# EAGLE design controller (EAGLE 6.6.0)
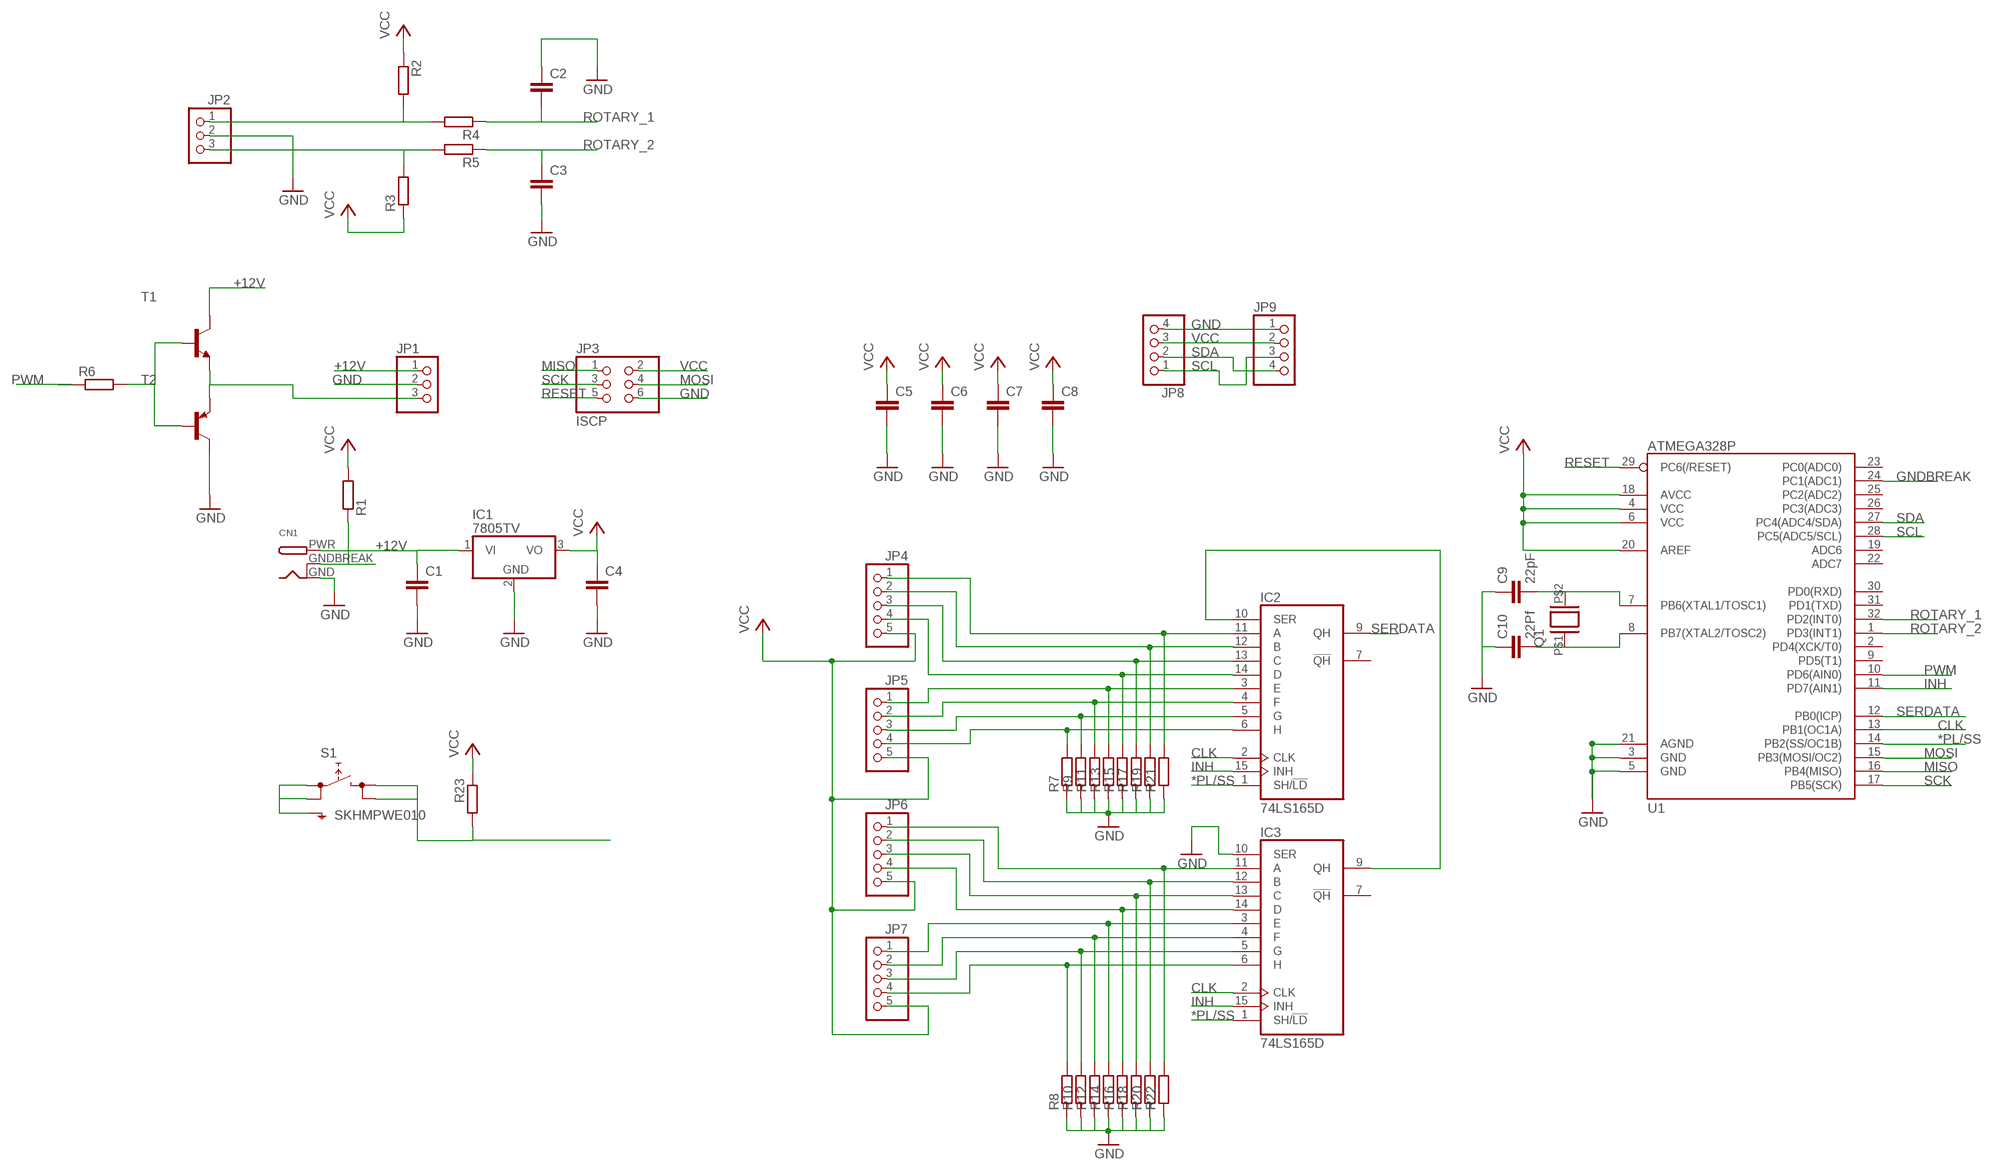
[diagram p0: schematic, sheet 1]

## Parts
C1  C-EUC0805  [C0805]
C2  C-EUC0805  [C0805]
C3  C-EUC0805  [C0805]
C4  C-EUC0805  [C0805]
C5  C-EUC0805  [C0805]
C6  C-EUC0805  [C0805]
C7  C-EUC0805  [C0805]
C8  C-EUC0805  [C0805]
C9  22pF  C-EUC0805  [C0805]
C10  22Pf  C-EUC0805  [C0805]
CN1  DCBARRELPTH  [DCJACK_2MM_PTH]
IC1  7805TV  [TO220V]
IC2  74LS165D  [SO16]
IC3  74LS165D  [SO16]
JP1  PINHD-1X3  [1X03]
JP2  PINHD-1X3  [1X03]
JP3  ISCP  PINHD-2X3  [2X03]
JP4  PINHD-1X5  [1X05]
JP5  PINHD-1X5  [1X05]
JP6  PINHD-1X5  [1X05]
JP7  PINHD-1X5  [1X05]
JP8  PINHD-1X4  [1X04]
JP9  PINHD-1X4  [1X04]
Q1  XTAL  [CSM-3X]
R1  R-EU_R0805  [R0805]
R2  R-EU_R0805  [R0805]
R3  R-EU_R0805  [R0805]
R4  R-EU_R0805  [R0805]
R5  R-EU_R0805  [R0805]
R6  R-EU_R0805  [R0805]
R7  R-EU_R0805  [R0805]
R8  R-EU_R0805  [R0805]
R9  R-EU_R0805  [R0805]
R10  R-EU_R0805  [R0805]
R11  R-EU_R0805  [R0805]
R12  R-EU_R0805  [R0805]
R13  R-EU_R0805  [R0805]
R14  R-EU_R0805  [R0805]
R15  R-EU_R0805  [R0805]
R16  R-EU_R0805  [R0805]
R17  R-EU_R0805  [R0805]
R18  R-EU_R0805  [R0805]
R19  R-EU_R0805  [R0805]
R20  R-EU_R0805  [R0805]
R21  R-EU_R0805  [R0805]
R22  R-EU_R0805  [R0805]
R23  R-EU_R0805  [R0805]
S1  SKHMPWE010  [SKHMPXE010]
T1  BC847-NPN-SOT23-BEC  [SOT23-BEC]
T2  BC807-16-PNP-SOT23-BEC  [SOT23-BEC]
U1  ATMEGA328P  ATMEGA328_SMT  [TQFP32-08]

## Nets
*PL/SS: IC2.1(SH/!LD) IC3.1(SH/!LD) U1.14(PB2(SS/OC1B))
+12V [high power]: C1.1 CN1.PWR IC1.1(VI) JP1.1 T1.C
CLK: IC2.2(CLK) IC3.2(CLK) U1.13(PB1(OC1A))
GND [gnd]: C1.2 C2.1 C3.2 C4.2 C5.2 C6.2 C7.2 C8.2 C9.1 C10.1 CN1.GND IC1.2(GND) IC3.10(SER) JP1.2 JP2.2 JP3.6 JP8.4 JP9.1 R7.1 R8.1 R9.1 R10.1 R11.1 R12.1 R13.1 R14.1 R15.1 R16.1 R17.1 R18.1 R19.1 R20.1 R21.1 R22.1 S1.1(1.1) S1.2(1.2) S1.5(SH) T2.C U1.3(GND) U1.5(GND) U1.21(AGND)
GNDBREAK: CN1.GNDBREAK R1.1 U1.24(PC1(ADC1))
INH: IC2.15(INH) IC3.15(INH) U1.11(PD7(AIN1))
MISO: JP3.1 U1.16(PB4(MISO))
MOSI: JP3.4 U1.15(PB3(MOSI/OC2))
N$1: IC2.11(A) JP4.1 R21.2
N$2: IC2.12(B) JP4.2 R19.2
N$3: IC2.13(C) JP4.3 R17.2
N$4: IC2.14(D) JP4.4 R15.2
N$5: IC2.3(E) JP5.1 R13.2
N$6: IC2.4(F) JP5.2 R11.2
N$7: IC2.5(G) JP5.3 R9.2
N$8: IC2.6(H) JP5.4 R7.2
N$9: IC3.11(A) JP6.1 R22.2
N$10: IC3.12(B) JP6.2 R20.2
N$11: IC3.13(C) JP6.3 R18.2
N$12: IC3.14(D) JP6.4 R16.2
N$13: IC3.3(E) JP7.1 R14.2
N$14: IC3.4(F) JP7.2 R12.2
N$15: IC3.5(G) JP7.3 R10.2
N$16: IC3.6(H) JP7.4 R8.2
N$17: JP2.1 R2.2 R4.2
N$18 [high power]: JP1.3 T1.E T2.E
N$19: JP2.3 R3.2 R5.2
N$21: IC2.10(SER) IC3.9(QH)
N$22: C9.2 Q1.P$2 U1.7(PB6(XTAL1/TOSC1))
N$23: C10.2 Q1.P$1 U1.8(PB7(XTAL2/TOSC2))
N$25: R6.2 T1.B T2.B
PWM: R6.1 U1.10(PD6(AIN0))
RESET: JP3.5 R23.2 S1.3(2.1) S1.4(2.2) U1.29(PC6(/RESET))
ROTARY_1: C2.2 R4.1 U1.32(PD2(INT0))
ROTARY_2: C3.1 R5.1 U1.1(PD3(INT1))
SCK: JP3.3 U1.17(PB5(SCK))
SCL: JP8.1 JP9.3 U1.28(PC5(ADC5/SCL))
SDA: JP8.2 JP9.4 U1.27(PC4(ADC4/SDA))
SERDATA: IC2.9(QH) U1.12(PB0(ICP))
VCC [vcc]: C4.1 C5.1 C6.1 C7.1 C8.1 IC1.3(VO) JP3.2 JP4.5 JP5.5 JP6.5 JP7.5 JP8.3 JP9.2 R1.2 R2.1 R3.1 R23.1 U1.4(VCC) U1.6(VCC) U1.18(AVCC) U1.20(AREF)
Unconnected: IC2.7(!QH) IC3.7(!QH) U1.2(PD4(XCK/T0)) U1.9(PD5(T1)) U1.19(ADC6) U1.22(ADC7) U1.23(PC0(ADC0)) U1.25(PC2(ADC2)) U1.26(PC3(ADC3)) U1.30(PD0(RXD)) U1.31(PD1(TXD))

## Power pins joined to a net without a drawn wire
GND: IC2.8(GND) IC3.8(GND)
VCC: IC2.16(VCC) IC3.16(VCC)

## Library data of the parts
C1-C10 = rcl:C-EU: CAPACITOR, European symbol
CN1 = adafruit:DCBARREL: 2.0mm DC Barrel Jack DCJACK_2MM_PTH - Through Hole Jack (4UConnector: 05537)
IC1 = linear:78*: Positive VOLTAGE REGULATOR Source: http://cache.national.com/ds/LM/LM78L05.pdf http://www.fairchildsemi.com/ds/LM/LM7805.pdf
IC2 IC3 = 74xx-us:74*165: 8-bit parallel load SHIFT REGISTER
JP1 JP2 = pinhead:PINHD-1X3: PIN HEADER
JP3 = pinhead:PINHD-2X3: PIN HEADER
JP4-JP7 = pinhead:PINHD-1X5: PIN HEADER
JP8 JP9 = pinhead:PINHD-1X4: PIN HEADER
Q1 = 1omat:XTAL: CRYSTAL
R1-R23 = resistor:R-EU_: RESISTOR, European symbol
S1 = switch:SKHMP*E010: 6.2 X 6.5mm TACT Switch (SMD) Source: http://www3.alps.co.jp/WebObjects/catalog.woa/PDF/E/Switch/Tact/SKHM/SKHM.PDF
T1 = transistor:*-NPN-: NPN Transistror BF959 corrected 2008.03.06
T2 = transistor:*-PNP-: PNP Transistror
U1 = SparkFun-DigitalIC:ATMEGA328_SMT: 32-Pin Atmega328 part Commonly used on Arduino compatible boards Available in QFP and QFN packages TQFP is IC-09069 QFN is non-stock; PROD_ID: IC-09069

## Net classes
0 default: width 0.254 mm
1 vcc: width 0.61 mm
2 gnd: width 0.61 mm
3 high power: width 1.422 mm

## Board
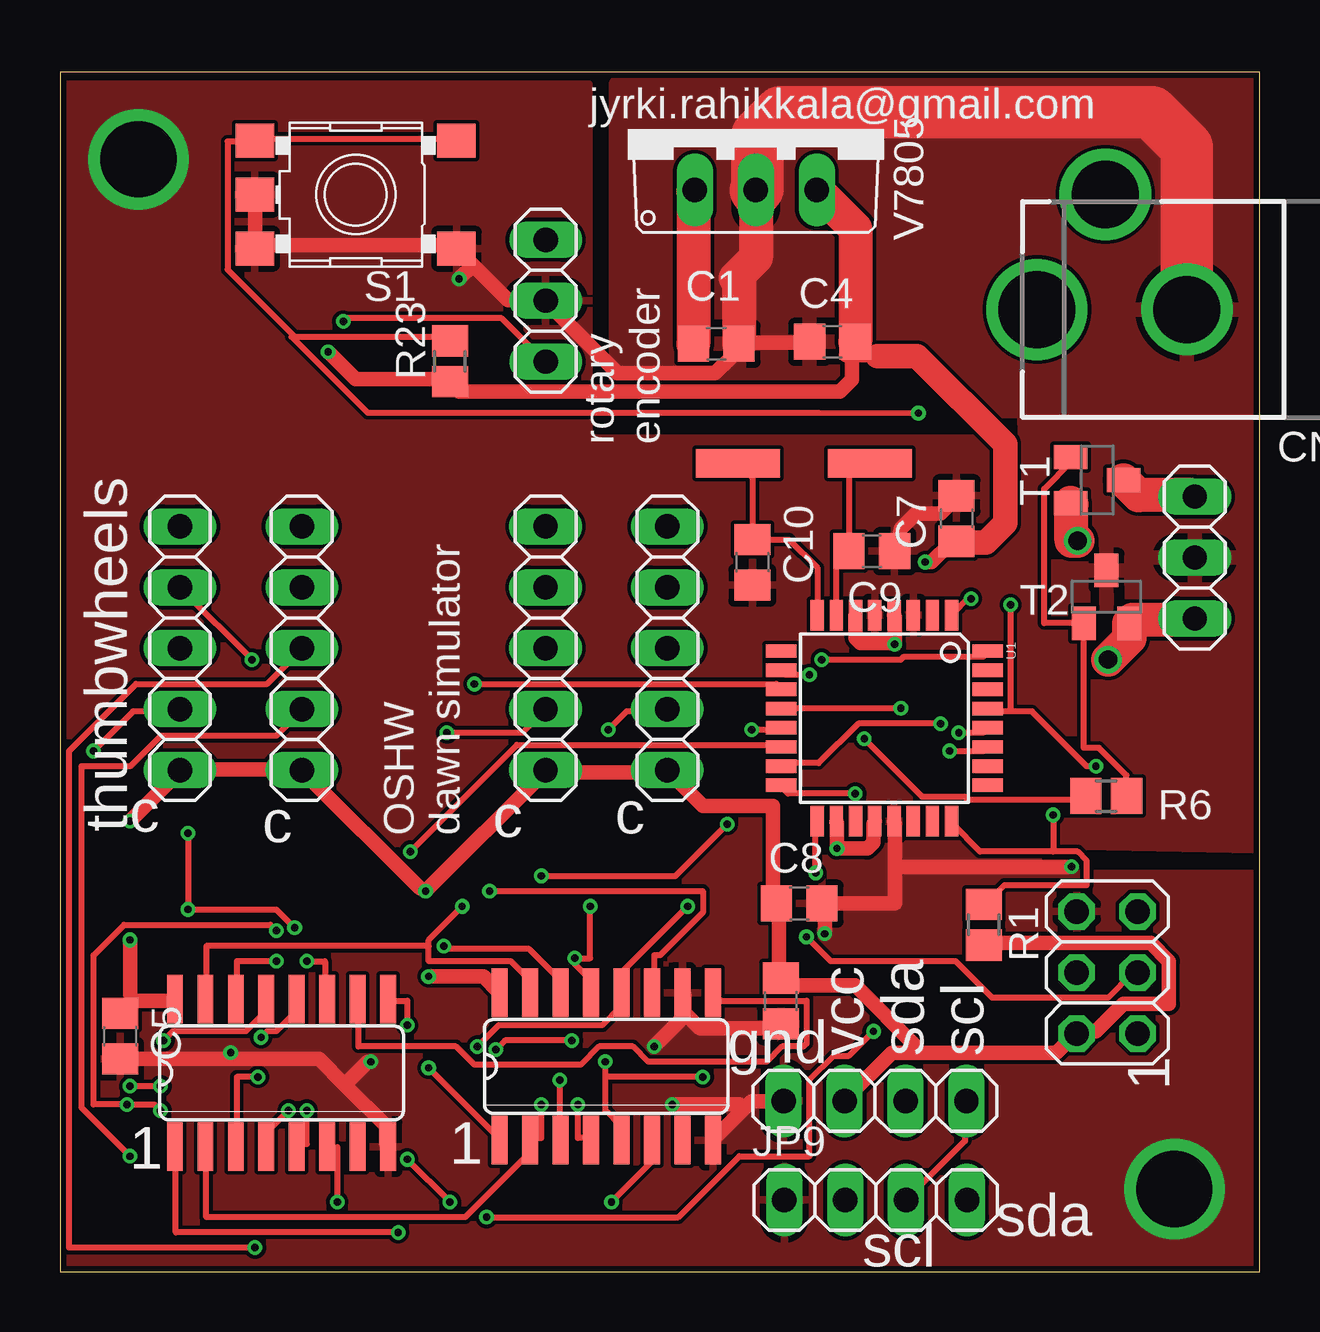
[diagram p1: board, top side]
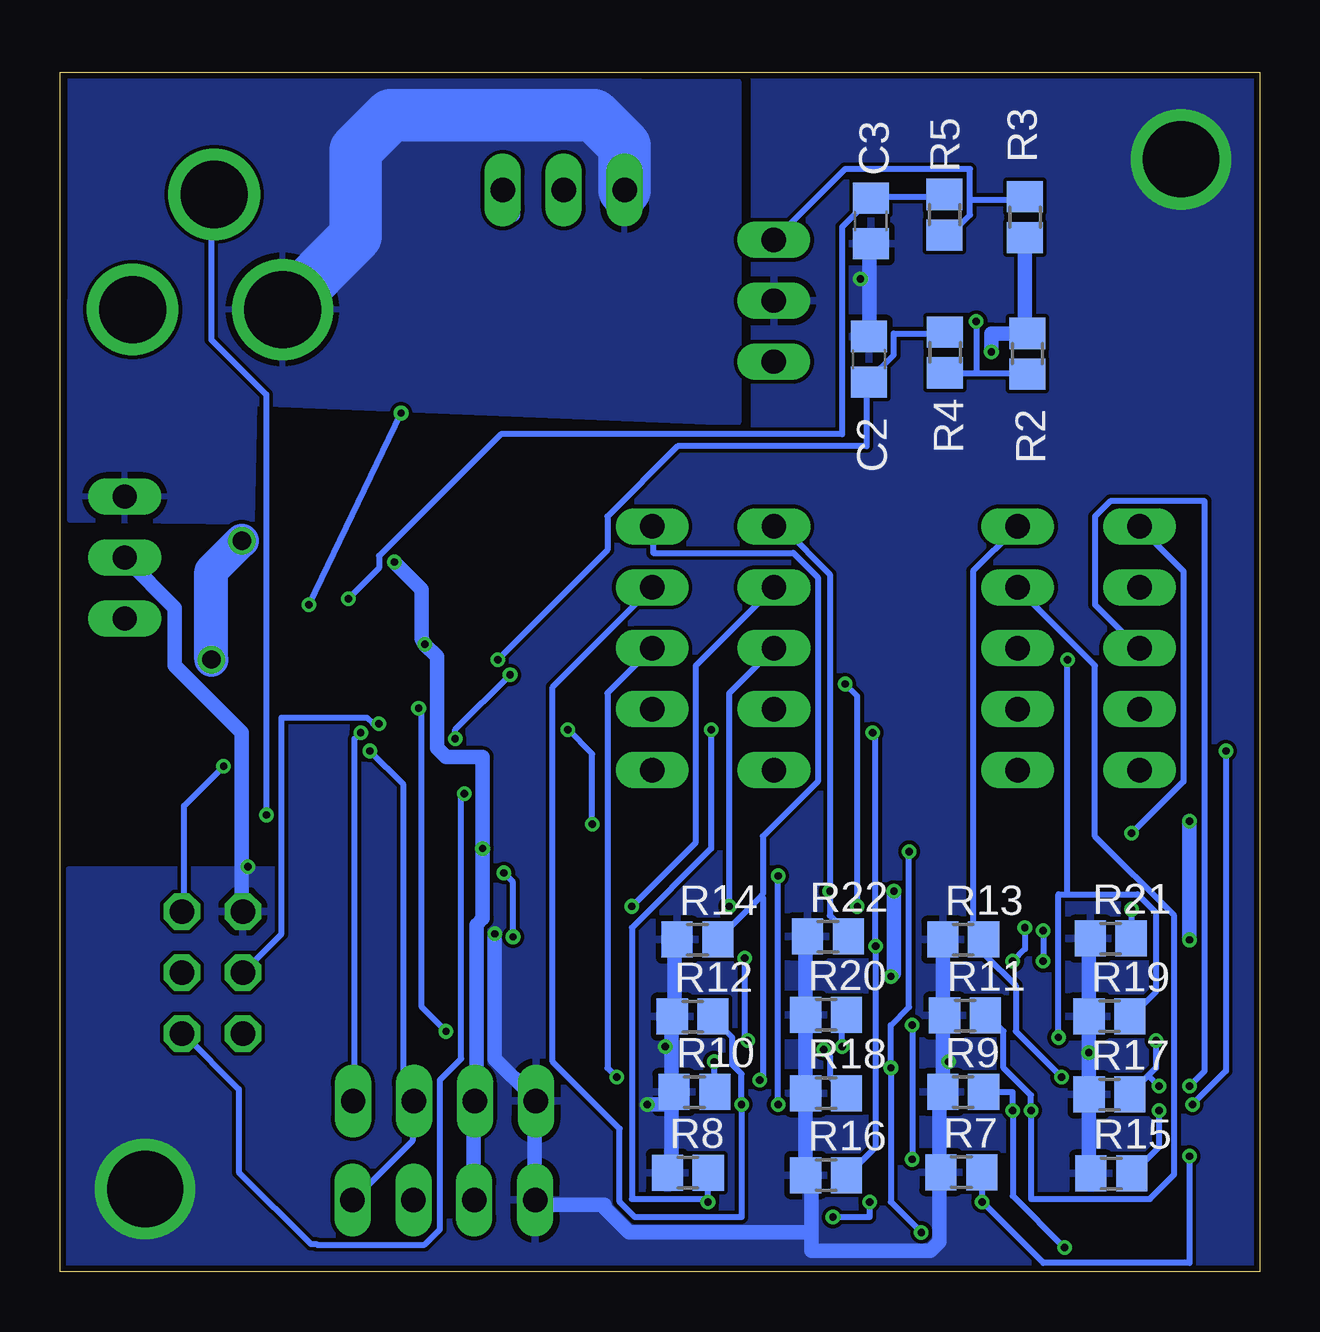
[diagram p2: board, bottom side, seen from below]

Size 50 x 50 mm. Coordinates in mm from the lower left corner, seen from the top.
Outline: 0,0 50,0 50,50 0,50 0,0
Copper layers (1*16): Top 0.035mm / dielectric 1.5mm / Bottom 0.035mm
Design rules "ITEADstudio_DRC": minimum track width 6mil, minimum drill 12mil, track to track 6mil, track to pad 6mil, pad to pad 6mil, via to via 6mil, smd to smd 0mil, copper to edge 10mil, drill to drill 10mil, minimum pad ring 10mil, minimum via ring 6mil, stop-mask expansion 2mil, vias tented up to drill 100mil, thermal gap 10mil

### Footprints (pad centres in the part's own frame; a part is rotated, then mirrored left to right if it is on the bottom)
C0805 = smd 1.3 x 1.5: 1 -0.95,0; 2 0.95,0
DCJACK_2MM_PTH = drill 2.8: GND 0,7.35; GNDBREAK 4.8,10.75 | drill 3.2: PWR 0,13.6
TO220V = drill 1.016 long: 1 -2.54,-2.54; 2 0,-2.54; 3 2.54,-2.54
SO16 = smd 0.66 x 2.032: 1 -4.445,-3.073; 2 -3.175,-3.073; 3 -1.905,-3.073; 4 -0.635,-3.073; 5 0.635,-3.073; 6 1.905,-3.073; 7 3.175,-3.073; 8 4.445,-3.073; 9 4.445,3.073; 10 3.175,3.073; 11 1.905,3.073; 12 0.635,3.073; 13 -0.635,3.073; 14 -1.905,3.073; 15 -3.175,3.073; 16 -4.445,3.073
1X03 = drill 1.016 long: 1 -2.54,0; 2 0,0; 3 2.54,0
2X03 = drill 1.016 octagon: 1 -2.54,-1.27; 2 -2.54,1.27; 3 0,-1.27; 4 0,1.27; 5 2.54,-1.27; 6 2.54,1.27
1X05 = drill 1.016 long: 1 -5.08,0; 2 -2.54,0; 3 0,0; 4 2.54,0; 5 5.08,0
1X04 = drill 1.016 long: 1 -3.81,0; 2 -1.27,0; 3 1.27,0; 4 3.81,0
CSM-3X = smd 3.5 x 1.2: P$1 -2.75,0; P$2 2.75,0
R0805 = smd 1.3 x 1.5: 1 -0.85,0; 2 0.85,0
SKHMPXE010 = smd 1.6 x 1.4: 1 -4.2,2.25; 2 4.2,2.25; 3 -4.2,-2.25; 4 4.2,-2.25; 5 4.2,0
SOT23-BEC = smd 1 x 1.4: B -0.95,-1.1; C 0,1.1; E 0.95,-1.1
TQFP32-08 = smd 1.27 x 0.559: 1 -4.293,2.8; 2 -4.293,2; 3 -4.293,1.2; 4 -4.293,0.4; 5 -4.293,-0.4; 6 -4.293,-1.2; 7 -4.293,-2; 8 -4.293,-2.8; 17 4.293,-2.8; 18 4.293,-2; 19 4.293,-1.2; 20 4.293,-0.4; 21 4.293,0.4; 22 4.293,1.2; 23 4.293,2; 24 4.293,2.8 | smd 0.559 x 1.27: 9 -2.8,-4.293; 10 -2,-4.293; 11 -1.2,-4.293; 12 -0.4,-4.293; 13 0.4,-4.293; 14 1.2,-4.293; 15 2,-4.293; 16 2.8,-4.293; 25 2.8,4.293; 26 2,4.293; 27 1.2,4.293; 28 0.4,4.293; 29 -0.4,4.293; 30 -1.2,4.293; 31 -2,4.293; 32 -2.8,4.293

### Placement (x,y rotation side)
C1  27.35,38.69 0 top
C2  16.28,38.05 270 bottom
C3  16.21,43.81 270 bottom
C4  32.2,38.77 180 top
C5  2.51,9.84 270 top
C6  30.04,11.3 270 top
C7  37.37,31.41 90 top
C8  30.81,15.36 0 top
C9  33.84,30.04 180 top
C10  28.86,29.58 90 top
CN1  54.32,40.12 90 top
IC1  29.01,47.64 0 top
IC2  9.24,8.3 0 top
IC3  22.77,8.57 0 top
JP1  47.3,29.78 270 top
JP2  20.24,40.49 90 top
JP3  43.65,12.48 90 top
JP4  5,26 270 top
JP5  10.08,26 270 top
JP6  20.24,26 270 top
JP7  25.32,26 270 top
JP8  33.97,7.13 180 top
JP9  34,3 0 top
Q1  31.01,33.71 0 top
R1  38.51,14.48 270 top
R2  9.68,38.28 270 bottom
R3  9.78,43.97 90 bottom
R4  13.11,38.33 270 bottom
R5  13.13,44.07 270 bottom
R6  43.61,19.84 0 top
R7  12.43,4.17 0 bottom
R8  23.83,4.14 0 bottom
R9  12.35,7.51 0 bottom
R10  23.55,7.51 0 bottom
R11  12.27,10.69 0 bottom
R12  23.63,10.65 0 bottom
R13  12.35,13.85 0 bottom
R14  23.43,13.86 0 bottom
R15  6.18,4.11 0 bottom
R16  18.07,4.04 0 bottom
R17  6.25,7.4 0 bottom
R18  18.07,7.46 0 bottom
R19  6.25,10.67 0 bottom
R20  18.07,10.72 0 bottom
R21  6.2,13.9 0 bottom
R22  17.99,13.98 0 bottom
R23  16.25,37.96 90 top
S1  12.32,44.91 180 top
T1  43.23,33.01 270 top
T2  43.62,28.14 0 top
U1  34.36,23.08 270 top

### Tracks (layer width: path | path; a pad name or v marks a point on that pad's centre or on a via)
*PL/SS  (via drill 0.3)
  Top 0.254: v14.61,17.53 19.05,21.97 29.97,21.97 U1.14 | v15.37,8.51 18.29,5.59 IC3.1 | v14.1,1.65 4.83,1.65 4.83,5.21 IC2.1
  Bottom 0.254: v14.61,17.53 14.61,11.05 15.37,10.29 v15.37,8.51 15.37,2.92 v14.1,1.65
+12V
  Top 1.422: IC1.1 26.4,45.04 C1.1 | T1.C 44.45,32.89 44.96,32.38 47.24,32.38 JP1.1
  Bottom 2.184: CN1.PWR 37.67,43.17 37.67,46.77 36.21,48.22 27.74,48.22 26.47,46.95 IC1.1
  pour Bottom: 23.01,35.42 41.91,36.2 42.01,31.27 49.58,31.34 49.56,49.76 21.8,49.62 21.72,49.62 21.72,35.42
CLK  (via drill 0.3)
  Top 0.254: v28.83,22.61 29.97,22.61 U1.13 | v27.81,18.67 25.65,16.51 v20.07,16.51 | v20.07,6.99 20.07,5.59 19.68,5.59 IC3.2 19.56,5.46 19.56,4.95 16.89,2.29 6.1,2.29 6.1,5.21 IC2.2
  Bottom 0.254: v28.83,22.61 27.81,21.59 v27.81,18.67 | v20.07,6.99 v20.07,16.51
GND  (via drill 0.3, 3.17)
  Top 0.61: 28.3,38.73 31.24,38.73 C4.2 | 7.11,8.89 10.79,8.89 11.87,7.81 | 7.11,8.89 2.54,8.89 C5.2 | 11.87,7.81 13.59,6.1 13.59,5.33 IC2.8 | v7.11,9.14 7.11,8.89 | 26.1,10.73 26.04,10.79 26.04,11.56 IC3.10 | 26.1,10.73 26.67,10.16 29.84,10.16 29.97,10.29 C6.2 | v24.77,9.4 26.1,10.73 | 28.51,6.79 28.83,7.11 30.1,7.11 JP8.4 | 28.51,6.79 27.3,5.59 IC3.8 | v25.53,6.99 28.32,6.99 28.51,6.79 | 11.87,7.81 12.83,8.76 v12.95,8.76 | S1.5 8.13,44.83 8.13,42.67 S1.2 8.38,42.8 16.26,42.8 S1.1 16.64,42.55 17.21,41.97 | 17.21,41.97 18.67,40.51 20.19,40.51 JP2.2 20.45,40.26 23.24,37.47 27.3,37.47 27.94,38.1 C1.2 | 17.21,41.97 v16.64,41.4 | C7.2 37.34,32.26 36.7,31.62 35.69,31.62 35.05,30.99 C9.1 | 34.8,16.89 34.8,15.37 31.88,15.37 C8.2 31.88,15.11 v31.88,14.1 | 34.8,16.89 34.8,18.67 U1.21 | v42.16,16.89 34.8,16.89
  Top 1.422: IC1.2 29.01,42.28 28.16,41.43 28.3,41.29 28.3,38.73 C1.2
  Top 2.184: CN1.GND 46.98,46.88 45.52,48.34 30.03,48.34 29.07,47.38 29.07,45.16 IC1.2
  Bottom 0.61: R15.1 7.11,4.19 7.11,7.37 R17.1 7.11,7.62 v7.11,9.14 7.11,10.54 R19.1 7.11,10.92 7.11,13.84 R21.1 | 24.51,9.4 24.51,10.54 R12.1 24.38,10.92 24.38,13.84 R14.1 | 24.51,9.4 24.51,7.62 R10.1 | R8.1 24.64,4.19 24.51,4.32 24.51,7.24 R10.1 | v24.77,9.4 24.51,9.4 | 13.21,8.76 13.21,10.67 R11.1 13.21,10.92 R13.1 | 13.21,8.76 13.21,7.62 R9.1 13.34,7.24 13.34,4.19 R7.1 13.34,3.94 13.34,1.27 13.72,0.89 18.67,0.89 18.67,1.65 | R22.1 18.92,13.97 18.92,10.92 R20.1 18.92,10.67 18.92,7.75 R18.1 18.92,7.37 18.92,4.06 R16.1 18.67,3.94 18.67,1.65 | 18.67,1.65 26.29,1.65 27.3,2.67 27.3,2.79 29.97,2.79 JP9.1 30.23,3.05 30.23,7.11 JP8.4 30.35,7.37 31.88,8.89 v31.88,14.1 | v25.53,6.99 24.77,6.99 R10.1 | v12.95,8.76 13.21,8.76 | 16.26,41.4 16.26,42.8 C3.2 | 16.26,41.4 16.26,39.12 C2.1 | v16.64,41.4 16.26,41.4 | 42.42,16.89 42.42,22.48 45.21,25.27 45.21,27.69 47.24,29.72 JP1.2 | 42.42,16.89 42.42,15.11 JP3.6 | v42.16,16.89 42.42,16.89
  other vias: 46.45,3.45 3.27,46.38
  pour Top: 23.18,49.54 49.63,49.54 49.88,17.74 40.51,17.92 40.2,35.9 23.17,35.86 23.17,49.54 23.2,49.51
  pour Top: 0.3,49.5 22.05,49.5 22.05,34.75 40.77,34.75 40.77,16.62 49.61,16.62 49.81,16.62 49.81,0.25 0.3,0.25
  pour Bottom: 0.15,49.86 21.05,49.86 21.05,34.88 40.56,34.88 40.56,16.76 49.61,16.76 49.61,16.68 49.76,16.68 49.76,0.23 0.15,0.23
GNDBREAK  (via drill 0.3)
  Top 0.254: 41.4,17.53 42.42,17.53 42.8,17.14 42.8,16.13 39.37,16.13 38.61,15.37 R1.1 | 41.4,17.53 38.35,17.53 37.21,18.67 U1.24 | v41.4,19.05 41.4,17.53
  Bottom 0.254: v41.4,19.05 41.4,36.58 43.69,38.86 43.69,44.83 CN1.GNDBREAK
INH  (via drill 0.3)
  Top 0.254: v17.27,24.51 29.84,24.51 29.97,24.38 U1.11 | v16.76,15.24 15.37,13.84 15.37,13.59 | 15.37,13.59 15.37,12.95 18.8,12.95 19.56,12.19 19.56,11.68 IC3.15 | 15.37,13.59 6.1,13.59 6.1,11.43 IC2.15
  Bottom 0.254: v17.27,24.51 16.76,24 v16.76,15.24
MISO  (via drill 0.3)
  Top 0.254: v33.15,19.94 30.35,19.94 30.1,20.19 U1.16
  Bottom 0.254: v33.15,19.94 33.27,19.81 33.27,8.89 34.16,8 34.16,1.78 34.8,1.14 39.29,1.14 39.32,1.17 39.55,1.17 42.55,4.17 42.55,7.62 44.83,9.91 JP3.1
MOSI  (via drill 0.3)
  Top 0.254: v36.7,22.86 33.27,22.86 31.62,21.21 30.1,21.21 U1.15
  Bottom 0.254: v36.7,22.86 36.96,22.86 37.21,23.11 40.77,23.11 40.77,14.1 42.29,12.57 JP3.4
N$1  (via drill 0.3)
  Top 0.254: v5.33,18.29 v5.33,15.11 9.02,15.11 v9.78,14.35 | v10.29,12.95 11.05,12.95 11.05,11.43 IC2.11
  Bottom 0.254: v5.33,15.11 5.33,13.97 R21.2 | v5.33,18.29 3.17,20.45 3.17,29.21 4.95,30.99 JP4.1 | v10.29,12.95 9.78,13.46 v9.78,14.35
N$2  (via drill 0.3)
  Top 0.254: v8.38,9.78 8.64,10.03 9.02,10.03 9.78,10.79 9.78,11.3 IC2.12 | v8,25.53 5.08,28.45 JP4.2
  Bottom 0.254: 8,15.75 8.38,15.75 v8.38,9.78 | 8,15.75 5.08,15.75 4.32,14.99 4.32,11.68 5.33,10.67 R19.2 | 8,15.75 v8,25.53
N$3  (via drill 0.3)
  Top 0.254: v4.32,9.65 4.7,10.03 7.75,10.03 8.51,10.79 8.51,11.3 IC2.13 | v4.19,7.75 v2.92,7.75
  Bottom 0.254: 4.64,8.19 4.32,8.51 v4.32,9.65 | 4.64,8.19 5.33,7.49 R17.2 | v2.92,7.75 2.29,8.38 2.29,32.13 6.22,32.13 6.86,31.5 6.86,27.81 5.08,26.04 JP4.3 | 4.64,8.19 v4.19,7.75
N$4  (via drill 0.3)
  Top 0.254: v4.19,6.73 3.94,6.99 v2.79,6.99 1.4,6.99 1.4,13.21 2.67,14.48 8.76,14.48 v9.02,14.22 | v1.4,21.72 3.05,23.37 4.95,23.37 JP4.4 | v9.02,12.95 7.37,12.95 7.37,11.43 IC2.14
  Bottom 0.254: v4.19,6.73 4.19,5.21 5.21,4.19 R15.2 | v2.79,6.99 1.4,8.38 v1.4,21.72 | v9.02,14.22 v9.02,12.95
N$5  (via drill 0.3)
  Top 0.254: v8.26,8.13 7.37,8.13 7.37,5.33 IC2.3
  Bottom 0.254: JP5.1 10.16,30.99 11.94,29.21 11.94,14.35 11.56,13.97 R13.2 11.43,13.84 11.43,13.21 10.16,11.94 10.16,10.03 v8.26,8.13
N$6  (via drill 0.3)
  Top 0.254: v9.53,6.73 8.64,5.84 8.64,5.33 IC2.4
  Bottom 0.254: R11.2 11.3,10.67 10.67,10.03 10.67,8.51 9.53,7.37 v9.53,6.73 9.53,3.05 4.57,3.05 3.56,4.06 3.56,14.86 6.86,18.16 6.86,25.27 10.03,28.45 JP5.2
N$7  (via drill 0.3)
  Top 0.254: v10.29,6.73 10.29,5.33 9.91,5.33 IC2.5 | v8.13,1.02 0.38,1.02 0.38,21.72 3.17,24.51 8.64,24.51 10.03,25.91 JP5.3
  Bottom 0.254: R9.2 11.43,7.49 10.29,7.49 v10.29,6.73 10.29,3.17 v8.13,1.02
N$8  (via drill 0.3)
  Top 0.254: v11.56,2.92 11.56,5.21 11.18,5.21 IC2.6 | v2.92,4.83 0.89,6.86 0.89,21.08 2.92,21.08 4.19,22.35 9.02,22.35 10.03,23.37 JP5.4
  Bottom 0.254: R7.2 11.56,4.06 v11.56,2.92 9.02,0.38 2.92,0.38 v2.92,4.83
N$9  (via drill 0.3)
  Top 0.254: v17.91,15.88 26.8,15.88 26.8,14.99 25.02,13.21 24.77,13.21 24.77,11.68 IC3.11
  Bottom 0.254: R22.2 17.14,14.1 17.91,14.86 v17.91,15.88 17.91,29.08 19.81,30.99 20.19,30.99 JP6.1
N$10  (via drill 0.3)
  Top 0.254: v17.4,9.4 18.29,10.29 22.61,10.29 23.37,11.05 23.37,11.56 IC3.12 23.5,11.68 23.5,12.57 v26.16,15.24
  Bottom 0.254: v17.4,9.4 17.4,10.54 17.27,10.67 R20.2 | v26.16,15.24 23.5,17.91 23.5,25.27 20.32,28.45 JP6.2
N$11  (via drill 0.3)
  Top 0.254: v18.16,9.27 18.54,9.65 v21.34,9.65 | IC3.13 22.1,11.68 22.1,12.19 21.46,12.83 v21.46,13.08 22.1,13.08 v22.1,15.24
  Bottom 0.254: v18.16,9.27 17.91,9.02 17.91,8.13 17.27,7.49 R18.2 | v21.34,9.65 21.46,9.78 v21.46,13.08 | v22.1,15.24 22.1,24.13 20.32,25.91 JP6.3
N$12  (via drill 0.3)
  Top 0.254: v16,13.59 16.13,13.46 19.56,13.46 20.83,12.19 20.83,11.68 IC3.14 | v16.13,22.48 19.3,22.48 20.19,23.37 JP6.4
  Bottom 0.254: R16.2 17.14,4.06 16,5.21 v16,13.59 16,22.35 v16.13,22.48
N$13  (via drill 0.3)
  Top 0.254: v20.83,8 20.83,5.59 IC3.3
  Bottom 0.254: 20.77,15.68 20.7,15.75 20.7,18.16 18.41,20.45 18.41,28.96 19.43,29.97 25.27,29.97 25.27,30.99 JP7.1 | 20.77,15.68 22.48,13.97 R14.2 | v20.83,8 20.7,8.13 20.7,15.62 20.77,15.68
N$14  (via drill 0.3)
  Top 0.254: v21.59,6.99 21.59,5.59 22.1,5.59 IC3.4
  Bottom 0.254: R12.2 22.73,10.54 21.97,9.78 21.97,8.64 21.59,8.26 v21.59,6.99 21.59,2.29 26.04,2.29 26.67,2.92 26.67,5.97 29.46,8.76 29.46,24.38 25.4,28.45 JP7.2
N$15  (via drill 0.3)
  Top 0.254: 22.73,8.13 22.73,6.73 23.37,6.1 23.37,5.59 IC3.5 | 22.73,8.13 v22.73,8.76 | v26.8,8.13 22.73,8.13
  Bottom 0.254: v22.73,8.76 22.73,7.62 R10.2 | v26.8,8.13 27.18,8.51 27.18,24.13 25.4,25.91 JP7.3
N$16  (via drill 0.3)
  Top 0.254: v22.99,2.92 24.64,4.57 24.64,5.46 IC3.6 | v22.86,22.61 23.62,23.37 25.27,23.37 JP7.4
  Bottom 0.254: 22.99,3.05 22.99,4.06 R8.2 | 22.99,3.05 26.16,3.05 26.16,14.35 22.86,17.65 v22.86,22.61 | 22.99,3.05 v22.99,2.92
N$17  (via drill 0.3)
  Top 0.254: v11.81,39.62 11.94,39.75 18.41,39.75 20.19,37.97 JP2.1
  Bottom 0.254: 11.81,37.47 13.08,37.47 R4.2 | 11.81,37.47 9.78,37.47 R2.2 | v11.81,39.62 11.81,37.47
N$18  (via drill 0.76)
  Top 1.422: JP1.3 47.24,27.18 44.7,27.18 T2.E 44.58,26.42 v43.69,25.53 | v42.42,30.48 42.16,30.48 42.16,32 T1.E
  Bottom 1.422: v42.42,30.48 43.69,29.21 v43.69,25.53
N$19
  Bottom 0.254: 12.06,44.7 9.78,44.7 R3.2 | 12.06,44.7 12.06,44.07 12.83,43.31 13.08,43.31 R5.2 | 12.06,44.7 12.06,45.97 17.27,45.97 20.19,43.05 JP2.3
N$21
  Top 0.254: IC2.10 12.45,11.3 12.45,9.4 16.51,9.4 17.27,8.64 21.72,8.64 22.48,9.4 23.88,9.4 24.51,8.76 29.46,8.76 30.1,9.4 30.99,9.4 31.11,9.53 31.11,11.3 27.56,11.3 27.3,11.56 IC3.9
N$22
  Top 0.254: Q1.P$2 32.89,33.91 32.89,30.99 C9.2 32.36,30.39 U1.7
N$23
  Top 0.254: U1.8 31.56,29.36 30.39,30.53 C10.2 28.86,33.11 Q1.P$1
N$25
  Top 0.254: 42.16,33.91 T1.B 42.16,33.78 41.02,32.64 41.02,27.05 42.55,27.05 T2.B 42.67,26.92 42.67,21.84 43.31,21.84 44.45,20.7 44.45,19.94 R6.2
PWM  (via drill 0.3)
  Top 0.254: v31.24,24.89 30.23,24.89 30.1,25.02 U1.10 | v33.53,22.23 35.94,19.81 37.72,19.81 37.85,19.68 42.55,19.68 42.67,19.81 R6.1
  Bottom 0.254: v31.24,24.89 33.53,22.61 v33.53,22.23
RESET  (via drill 0.3)
  Top 0.254: 39.62,23.37 40.51,23.37 42.8,21.08 v43.18,21.08 | 39.62,23.37 38.73,23.37 U1.29 | 9.72,39.05 6.99,41.78 6.99,47.12 8,47.12 S1.4 8.13,47.24 16.51,47.24 S1.3 | 9.72,39.05 9.78,38.99 16,38.99 16.13,38.86 R23.2 | v39.62,27.81 39.62,23.37 | v35.78,35.8 31.62,35.81 12.83,35.81 9.65,38.99 9.72,39.05
  Bottom 0.254: v43.18,21.08 44.83,19.43 44.83,15.11 JP3.5 | v35.78,35.8 v39.62,27.81
ROTARY_1  (via drill 0.3)
  Top 0.254: v31.75,25.53 35.05,25.53 35.18,25.65 38.48,25.65 38.61,25.78 U1.32
  Bottom 0.254: v31.75,25.53 27.18,30.1 27.18,31.5 24.26,34.42 16.38,34.42 16.38,37.08 C2.2 16.26,37.21 15.24,38.23 15.24,39.12 13.21,39.12 R4.1
ROTARY_2  (via drill 0.3)
  Top 0.254: v37.97,28.07 37.85,28.07 37.21,27.43 U1.1
  Bottom 0.254: v37.97,28.07 36.7,29.34 36.7,29.84 31.62,34.92 17.4,34.92 17.4,43.56 16.26,44.7 C3.1 16.13,44.83 13.21,44.83 R5.1
SCK  (via drill 0.3)
  Top 0.254: v31.5,16.64 31.5,18.67 U1.17 | v31.11,13.97 32.13,12.95 37.34,12.95 38.86,11.43 43.69,11.43 44.7,12.45 44.83,12.45 JP3.3
  Bottom 0.254: v31.5,16.64 31.11,16.26 v31.11,13.97
SCL  (via drill 0.3)
  Top 0.254: v37.47,22.48 38.48,22.48 38.61,22.61 U1.28 | JP9.3 35.31,3.05 37.72,5.46 37.72,7.11 JP8.1
  Bottom 0.254: v37.47,22.48 37.72,22.23 37.72,7.24 JP8.1
SDA  (via drill 0.3)
  Top 0.254: v37.08,21.72 38.48,21.72 38.61,21.84 U1.27
  Bottom 0.254: v37.08,21.72 35.69,20.32 35.69,7.62 35.31,7.24 JP8.2 35.31,7.11 35.31,5.46 37.72,3.05 JP9.4
SERDATA  (via drill 0.3)
  Top 0.254: v35.05,23.5 30.1,23.5 U1.12 | v33.91,10.03 32.89,9.02 32.26,9.02 31.24,8 31.24,4.83 28.32,4.83 25.78,2.29 v17.78,2.29 | v14.48,4.7 v16.26,2.92 | v14.48,10.29 14.48,11.3 13.72,11.3 IC2.9
  Bottom 0.254: v35.05,23.5 34.92,23.37 34.92,11.05 v33.91,10.03 | v17.78,2.29 16.26,2.29 v16.26,2.92 | v14.48,10.29 v14.48,4.7
VCC  (via drill 0.3)
  Top 0.61: v11.18,38.35 12.32,37.21 16,37.21 R23.1 16.26,37.08 16.64,36.7 32.52,36.7 33.02,37.21 33.02,38.65 C4.1 32.77,38.23 34.03,38.23 34.07,38.19 | 3.05,11.3 2.54,10.79 C5.1 | 3.05,11.3 4.7,11.3 IC2.16 | v2.92,13.84 2.92,11.56 3.05,11.3 | v2.92,18.8 4.95,20.83 JP4.5 5.21,20.95 10.03,20.95 JP5.5 10.29,20.7 14.99,16 v15.24,15.88 20.19,20.83 JP6.5 20.45,20.83 25.02,20.83 JP7.5 25.4,20.83 26.8,19.43 29.72,19.43 29.72,15.62 C8.1 29.97,15.24 29.97,12.32 C6.1 30.23,12.06 30.35,11.94 33.15,11.94 35.69,9.4 35.69,9.14 | v15.37,12.32 17.65,12.32 18.29,11.68 IC3.16 | R1.2 38.61,13.72 45.47,13.72 46.23,12.95 46.23,11.18 44.32,11.18 43.18,10.03 42.42,10.03 JP3.2 42.16,9.78 41.53,9.14 35.69,9.14 | U1.18 32.38,18.67 v32.38,17.65 33.66,17.65 33.91,17.91 33.91,18.67 U1.20 | U1.4 34.8,27.3 v34.8,26.16 34.74,26.22 33.36,26.22 33.16,26.42 U1.6 | 35.69,9.14 34.67,9.14 32.77,7.24 JP8.3 | v36.07,29.59 36.32,29.59 37.08,30.35 C7.1
  Top 1.016: 34.07,38.19 35.72,38.19 39.4,34.5 39.4,31.21 38.59,30.4 37.42,30.4 C7.1
  Top 1.422: IC1.3 33.15,43.5 C4.1
  Bottom 0.61: 31.11,44.07 31.11,44.7 31.5,45.09 IC1.3 | R3.1 9.78,39.24 R2.1 10.03,39.12 11.18,39.12 v11.18,38.35 | v2.92,18.8 v2.92,13.84 | v15.37,12.32 15.24,12.45 v15.24,15.88 | JP9.2 32.77,3.05 32.77,6.86 JP8.3 32.64,7.24 32.64,14.48 32.38,14.73 v32.38,17.65 32.38,21.46 33.91,21.46 34.29,21.84 34.29,25.65 v34.8,26.16 34.92,26.42 34.92,28.45 v36.07,29.59

### Text on the board
tNames: jyrki.rahikkala@gmail.com | V7805 | rotary / encoder | thumbwheels | c | c | c | c | OSHW / dawn simulator | gnd | vcc | sda | scl | 1 | 1 | 1 | scl | sda
200bmp: /home/jra/Lataukset/oshw-logo.bmp